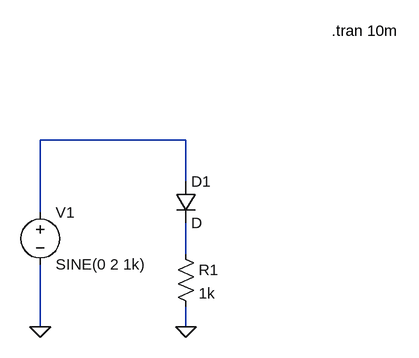
[diagram p0: schematic Diode1.asc]
Diode1.asc, the LTspice schematic file:
Version 4
SHEET 1 880 680
WIRE 288 32 64 32
WIRE 288 96 288 32
WIRE 64 144 64 32
WIRE 288 208 288 160
WIRE 64 320 64 224
WIRE 288 320 288 288
FLAG 64 320 0
FLAG 288 320 0
SYMBOL diode 272 96 R0
SYMATTR InstName D1
SYMBOL res 272 192 R0
SYMATTR InstName R1
SYMATTR Value 1k
SYMBOL voltage 64 128 R0
WINDOW 123 0 0 Left 0
WINDOW 39 0 0 Left 0
SYMATTR InstName V1
SYMATTR Value SINE(0 2 1k)
TEXT 512 -136 Left 2 !.tran 10m

The netlist it stands for:
* Diode1.asc
D1 N001 N002 D
R1 N002 0 1k
V1 N001 0 SINE(0 2 1k)
.model D D
.lib standard.dio
.tran 10m
.backanno
.end